# EAGLE design Day 0_Naufal Nashirul M_13215070 (EAGLE 7.5.0)
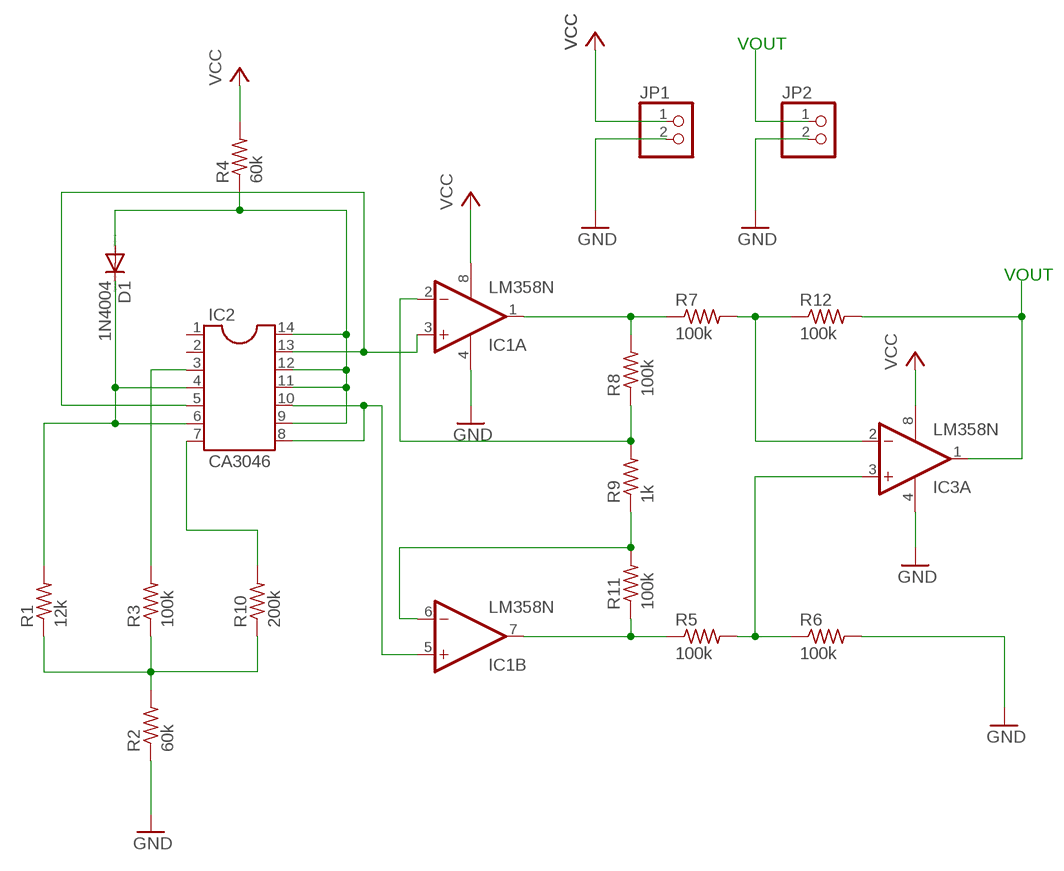
[diagram p0: schematic, sheet 1]

## Parts
D1  1N4004  DIODE-D-7.5  [D-7.5]
IC1  LM358N  [DIL08]
IC2  CA3046  DIL14  [DIL14]
IC3  LM358N  [DIL08]
JP1  PINHD-1X2  [1X02]
JP2  PINHD-1X2  [1X02]
R1  12k  R-US_0204/7  [0204/7]
R2  60k  R-US_0204/7  [0204/7]
R3  100k  R-US_0204/7  [0204/7]
R4  60k  R-US_0204/7  [0204/7]
R5  100k  R-US_0204/7  [0204/7]
R6  100k  R-US_0204/7  [0204/7]
R7  100k  R-US_0204/7  [0204/7]
R8  100k  R-US_0204/7  [0204/7]
R9  1k  R-US_0204/7  [0204/7]
R10  200k  R-US_0204/7  [0204/7]
R11  100k  R-US_0204/7  [0204/7]
R12  100k  R-US_0204/7  [0204/7]

## Nets
GND: IC1.4(P:V-) IC3.4(P:V-) JP1.2 JP2.2 R2.1 R6.2
MALE_HEADER1: JP1.1 ; supply symbol labelled VCC
N$1: D1.A IC2.9 IC2.11 IC2.12 IC2.14 R4.1
N$2: D1.C IC2.4 IC2.6 R1.2
N$3: IC2.3 R3.2
N$4: IC2.7 R10.2
N$5: R1.1 R2.2 R3.1 R10.1
N$6: IC1.1(A:OUT) R7.1 R8.2
N$7: IC1.3(A:+IN) IC2.5 IC2.13
N$8: IC1.5(B:+IN) IC2.8 IC2.10
N$9: IC3.2(A:-IN) R7.2 R12.1
N$10: IC1.2(A:-IN) R8.1 R9.2
N$11: IC1.7(B:OUT) R5.1 R11.1
N$12: IC3.3(A:+IN) R5.2 R6.1
N$13: IC1.6(B:-IN) R9.1 R11.2
N$14: IC3.1(A:OUT) R12.2
N$15: JP2.1
VCC: IC1.8(P:V+) IC3.8(P:V+) R4.2
Unconnected: IC2.1 IC2.2 IC3.5(B:+IN) IC3.6(B:-IN) IC3.7(B:OUT)

## Notes on the sheet
- VOUT
- VOUT

## Library data of the parts
D1 = diode:DIODE-: DIODE
IC1 IC3 = linear:LM358: OP AMP also LM158; LM258; LM2904 Source: http://cache.national.com/ds/LM/LM158.pdf
IC2 = ic-package:DIL14: Dual In Line / Socket
JP1 JP2 = pinhead:PINHD-1X2: PIN HEADER
R1-R12 = resistor:R-US_: RESISTOR, American symbol

## Board
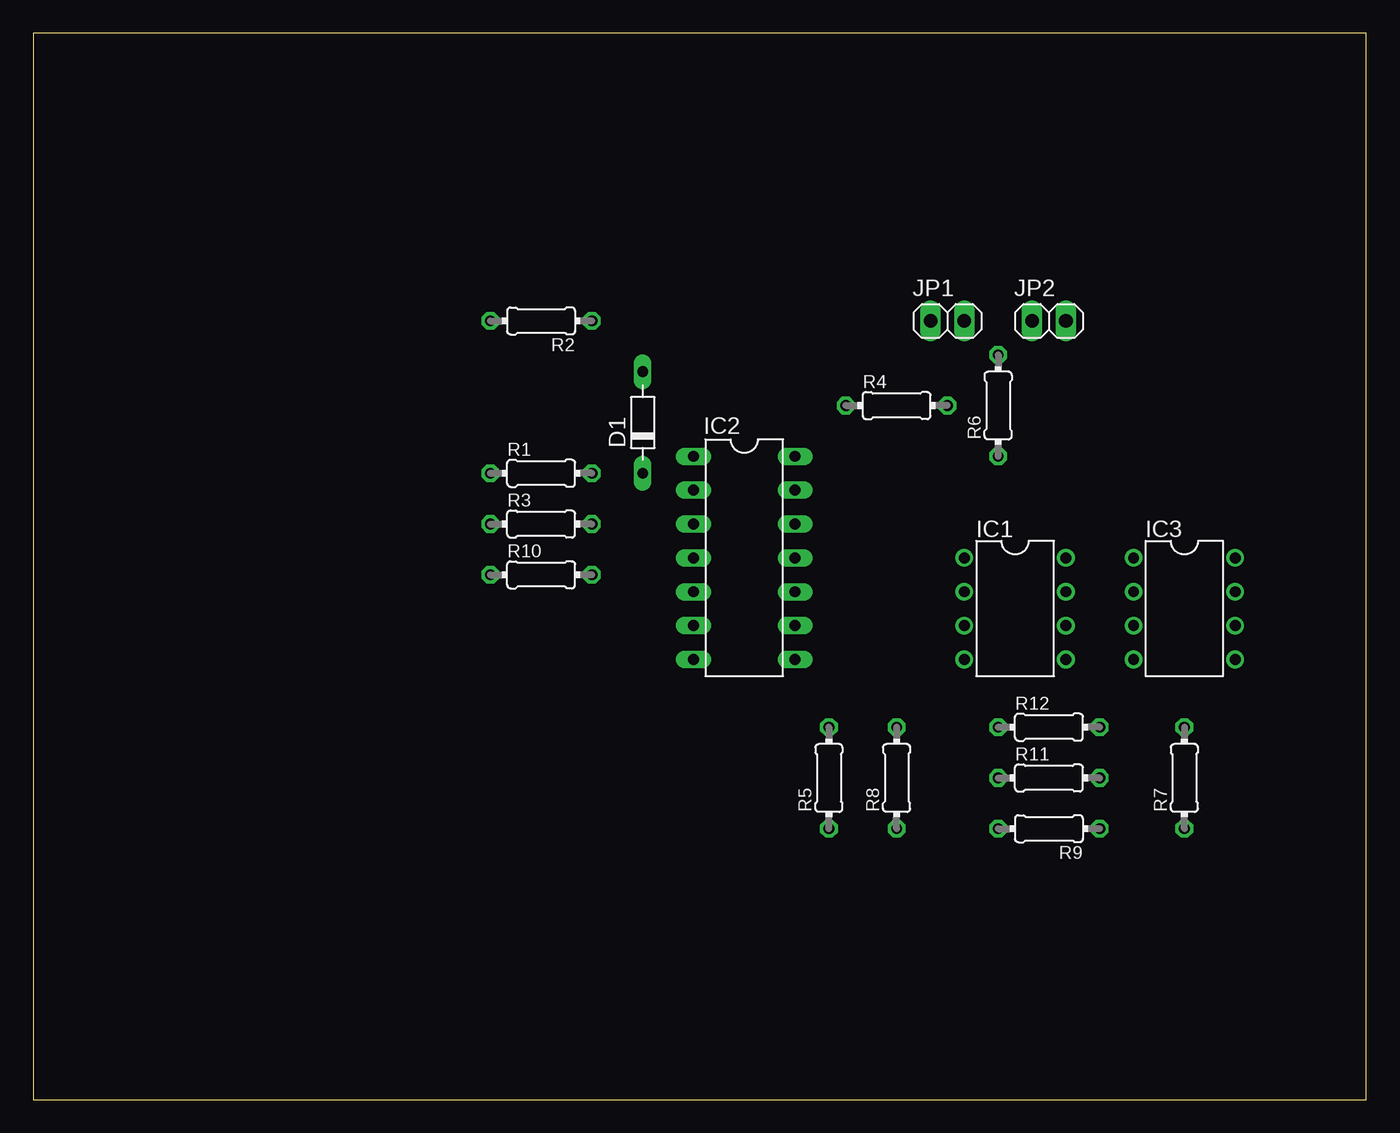
[diagram p1: board, top side]
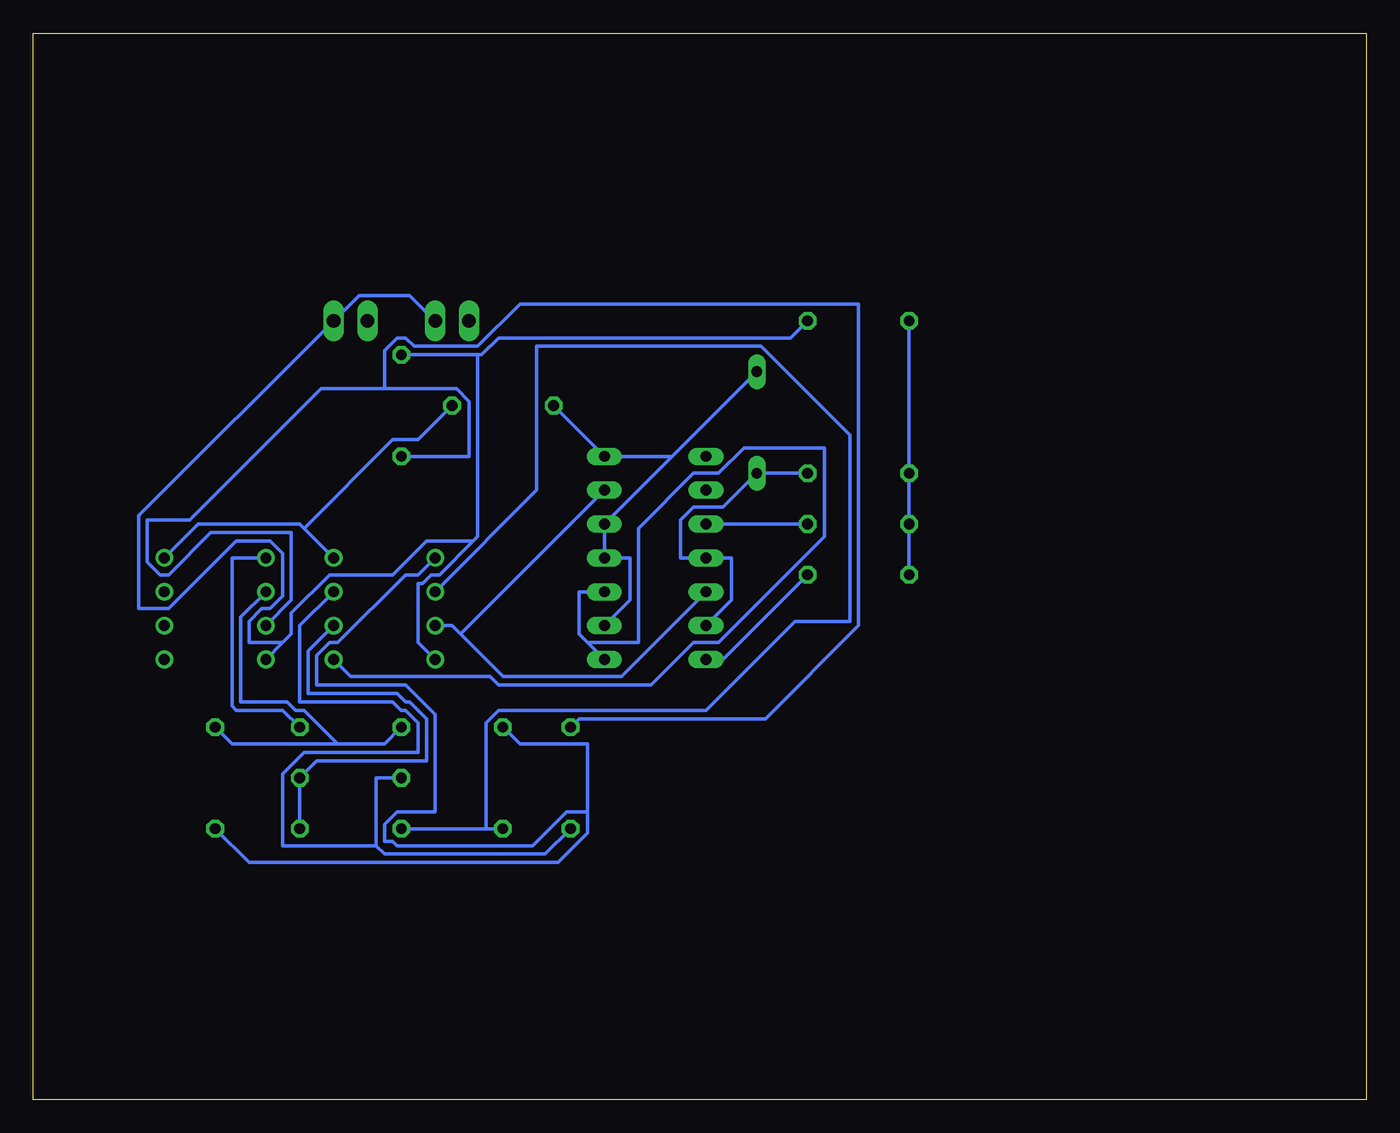
[diagram p2: board, bottom side, seen from below]

Size 100 x 80 mm. Coordinates in mm from the lower left corner, seen from the top.
Outline: 0,0 100,0 100,80 0,80 0,0
Copper layers (1*16): Top 0.035mm / dielectric 1.5mm / Bottom 0.035mm
Design rules "default": minimum track width 10mil, minimum drill 24mil, track to track 8mil, track to pad 8mil, pad to pad 8mil, via to via 8mil, smd to smd 8mil, copper to edge 40mil, drill to drill 8mil, minimum pad ring 10mil, minimum via ring 8mil, stop-mask expansion 4mil, vias tented up to drill 0mil, thermal gap 10mil

### Footprints (pad centres in the part's own frame; a part is rotated, then mirrored left to right if it is on the bottom)
D-7.5 = drill 0.813 long: A 3.81,0; C -3.81,0
DIL08 = drill 0.813 pad 1.27: 1 -3.81,-3.81; 2 -1.27,-3.81; 3 1.27,-3.81; 4 3.81,-3.81; 5 3.81,3.81; 6 1.27,3.81; 7 -1.27,3.81; 8 -3.81,3.81
DIL14 = drill 0.813 long: 1 -7.62,-3.81; 2 -5.08,-3.81; 3 -2.54,-3.81; 4 0,-3.81; 5 2.54,-3.81; 6 5.08,-3.81; 7 7.62,-3.81; 8 7.62,3.81; 9 5.08,3.81; 10 2.54,3.81; 11 0,3.81; 12 -2.54,3.81; 13 -5.08,3.81; 14 -7.62,3.81
1X02 = drill 1.016 long: 1 -1.27,0; 2 1.27,0
0204/7 = drill 0.813 octagon: 1 -3.81,0; 2 3.81,0

### Placement (x,y rotation side)
D1  45.72,50.8 90 top
IC1  73.66,36.83 270 top
IC2  53.34,40.64 270 top
IC3  86.36,36.83 270 top
JP1  68.58,58.42 0 top
JP2  76.2,58.42 0 top
R1  38.1,46.99 0 top
R2  38.1,58.42 180 top
R3  38.1,43.18 0 top
R4  64.77,52.07 0 top
R5  59.69,24.13 90 top
R6  72.39,52.07 90 top
R7  86.36,24.13 90 top
R8  64.77,24.13 90 top
R9  76.2,20.32 180 top
R10  38.1,39.37 0 top
R11  76.2,24.13 0 top
R12  76.2,27.94 0 top

### Tracks (layer width: path | path; a pad name or v marks a point on that pad's centre or on a via)
GND
  Bottom 0.254: JP1.2 71.75,60.33 75.56,60.33 JP2.2 92.08,43.81 92.08,36.83 89.85,36.83 84.77,41.91 82.23,41.91 81.28,40.96 81.28,37.78 82.23,36.83 82.87,36.83 83.82,35.88 83.82,34.29 81.28,34.29 | R2.1 43.18,57.15 65.09,57.15 66.36,55.88 66.67,55.88 | R6.2 66.67,55.88 | IC1.4 71.12,34.29 71.12,38.73 70.8,38.73 70.17,39.37 69.53,39.37 66.99,41.91 | 66.99,41.91 66.67,42.23 66.67,55.88 | 81.28,34.29 80.64,34.92 80.64,36.51 77.79,39.37 73.03,39.37 70.48,41.91 66.99,41.91 | 81.28,34.29 IC3.4
N$1
  Bottom 0.254: IC2.9 55.24,37.47 55.24,40.64 IC2.11 IC2.12 52.07,48.26 | 52.07,48.26 D1.A | 52.07,48.26 IC2.14 R4.1
N$2
  Bottom 0.254: R1.2 D1.C 48.26,44.45 50.48,44.45 51.44,43.5 51.44,40.64 IC2.4 47.62,40.64 47.62,37.47 IC2.6
N$3
  Bottom 0.254: IC2.3 R3.2
N$4
  Bottom 0.254: R10.2 48.26,33.02 IC2.7
N$5
  Bottom 0.254: R10.1 R3.1 R1.1 R2.2
N$6
  Bottom 0.254: R7.1 83.82,17.78 60.64,17.78 58.42,20 58.42,21.59 | 58.42,21.59 58.42,26.67 63.5,26.67 R8.2 | IC1.1 71.12,39.37 72.07,39.37 77.15,34.29 77.79,34.29 78.74,33.34 78.74,31.11 72.07,31.11 69.85,28.89 69.85,21.59 72.71,21.59 73.66,20.64 73.66,19.37 73.03,19.37 72.71,19.05 62.55,19.05 60.01,21.59 58.42,21.59
N$7
  Bottom 0.254: IC2.5 55.88,31.75 64.77,31.75 67.94,34.92 | 67.94,34.92 68.58,35.56 IC1.3 | 67.94,34.92 IC2.13
N$8
  Bottom 0.254: 58.42,34.29 59.05,34.92 59.05,38.1 IC2.10 | 58.42,34.29 IC2.8 | IC1.5 76.2,31.75 65.72,31.75 65.09,31.11 53.66,31.11 50.48,34.29 48.58,34.29 40.64,42.23 40.64,48.9 46.67,48.9 48.58,46.99 50.48,46.99 54.61,42.86 54.61,34.29 58.42,34.29
N$9
  Bottom 0.254: R12.1 73.66,26.67 77.15,26.67 | 77.15,26.67 85.09,26.67 R7.2 | IC3.2 84.45,36.2 84.45,29.84 80.96,29.84 80.33,29.21 79.69,29.21 77.15,26.67
N$10
  Bottom 0.254: R9.2 66.04,20.32 | 66.04,20.32 R8.1 | IC1.2 62.23,45.72 62.23,56.52 45.4,56.52 38.73,49.85 38.73,35.88 42.86,35.88 49.53,29.21 65.09,29.21 66.04,28.26 66.04,20.32
N$11
  Bottom 0.254: R5.1 61.59,18.41 73.66,18.41 74.3,19.05 | 74.3,19.05 74.3,24.13 R11.1 | IC1.7 80.01,35.56 80.01,29.84 73.03,29.84 72.39,29.21 72.07,29.21 71.12,28.26 71.12,26.04 79.69,26.04 81.28,24.45 81.28,19.05 74.3,19.05
N$12
  Bottom 0.254: R5.2 59.05,28.57 45.09,28.57 38.1,35.56 38.1,59.69 63.5,59.69 66.67,56.52 71.44,56.52 72.07,57.15 72.71,57.15 73.66,56.2 73.66,53.34 | 73.66,53.34 68.26,53.34 67.31,52.39 67.31,48.26 R6.1 | IC3.3 80.64,37.47 80.64,42.55 86.68,42.55 89.85,39.37 90.49,39.37 91.44,40.32 91.44,43.5 88.27,43.5 78.42,53.34 73.66,53.34
N$13
  Bottom 0.254: R9.1 R11.2 78.74,25.4 70.48,25.4 70.48,28.57 71.75,29.84 72.07,29.84 72.71,30.48 79.38,30.48 79.38,33.66 IC1.6
N$14
  Bottom 0.254: R12.2 81.28,29.21 84.77,29.21 85.09,29.53 85.09,40.64 IC3.1
VCC
  Bottom 0.254: 79.69,42.86 80.01,43.18 87.63,43.18 IC3.8 | 79.69,42.86 IC1.8 | R4.2 71.12,49.53 73.03,49.53 79.69,42.86